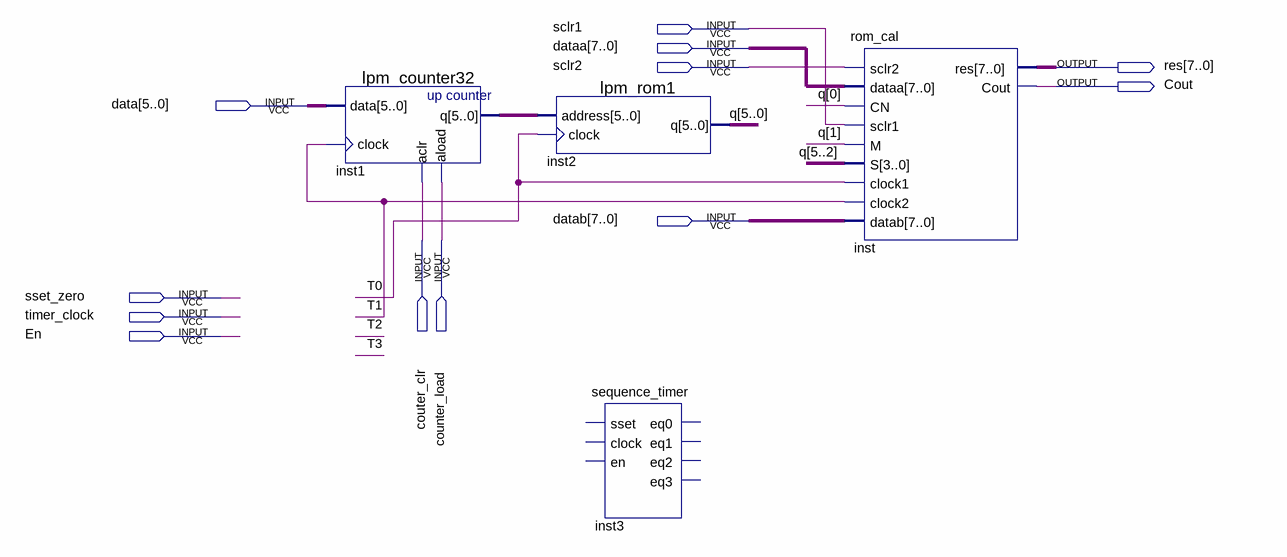
[diagram p0: schematic sheet]
// Quartus schematic counter.bdf as structural Verilog: 4 symbols, 12 pins
module counter (
  input  sclr1,
  input  [7:0] dataa,
  input  sclr2,
  input  [5:0] data,
  input  [7:0] datab,
  input  couter_clr,
  input  counter_load,
  input  sset_zero,
  input  timer_clock,
  input  En,
  output [7:0] res,
  output Cout
);

  wire T0, T1;
  wire [5:0] inst1_q, q;

  lpm_counter32 inst1 (.data(data), .clock(T1), .aclr(couter_clr), .aload(counter_load), .q(inst1_q));
  lpm_rom1 inst2 (.address(inst1_q), .clock(T0), .q(q));
  sequence_timer inst3 ();  // open: sset, clock, en, eq0, eq1, eq2, eq3
  rom_cal inst (
    .sclr2(sclr2), .dataa(dataa), .CN(q[0]), .sclr1(sclr1), .M(q[1]), .S(q[5:2]), .clock1(T0), .clock2(T1),
    .datab(datab), .res(res), .Cout(Cout));
endmodule
